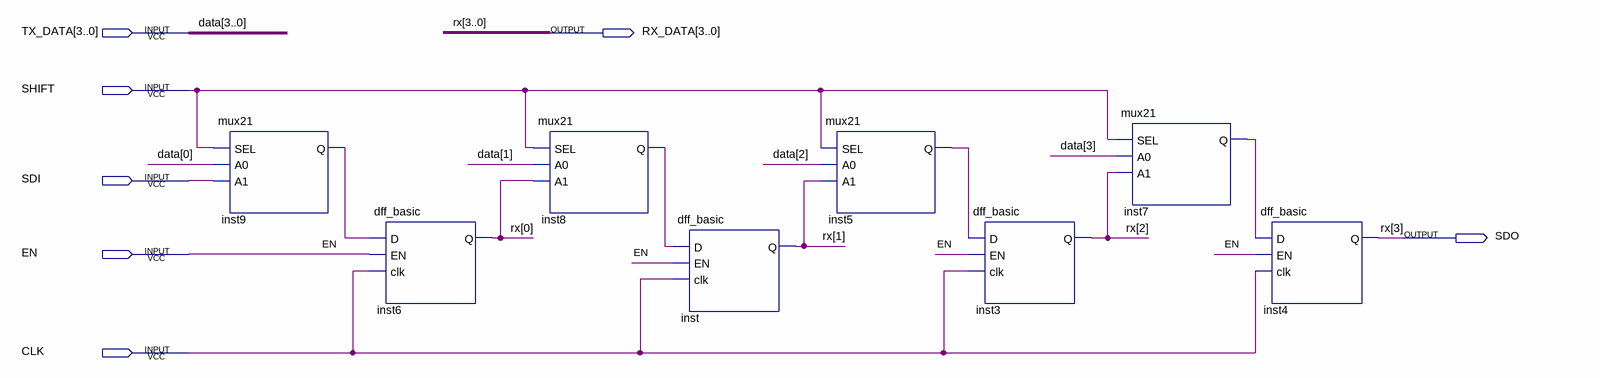
[diagram p0: schematic sheet]
// Quartus schematic top_level.bdf as structural Verilog: 8 symbols, 7 pins
module top_level (
  input  [3:0] TX_DATA,
  input  SHIFT,
  input  SDI,
  input  EN,
  input  CLK,
  output [3:0] RX_DATA,
  output SDO
);

  wire inst5_q, inst7_q, inst8_q, inst9_q;

  mux21 inst9 (.SEL(SHIFT), .A0(TX_DATA[0]), .A1(SDI), .Q(inst9_q));
  dff_basic inst6 (.D(inst9_q), .EN(EN), .clk(CLK), .Q(RX_DATA[0]));
  mux21 inst8 (.SEL(SHIFT), .A0(TX_DATA[1]), .A1(RX_DATA[0]), .Q(inst8_q));
  dff_basic inst (.D(inst8_q), .EN(EN), .clk(CLK), .Q(RX_DATA[1]));
  mux21 inst5 (.SEL(SHIFT), .A0(TX_DATA[2]), .A1(RX_DATA[1]), .Q(inst5_q));
  dff_basic inst3 (.D(inst5_q), .EN(EN), .clk(CLK), .Q(RX_DATA[2]));
  mux21 inst7 (.SEL(SHIFT), .A0(TX_DATA[3]), .A1(RX_DATA[2]), .Q(inst7_q));
  dff_basic inst4 (.D(inst7_q), .EN(EN), .clk(CLK), .Q(RX_DATA[3]));

  assign SDO = RX_DATA[3];

  // Other names for the same wires on the sheet: data[3:0] = TX_DATA; rx[3:0] = RX_DATA
endmodule
